# Altium schematic sheet Bank34-35.SchDoc: 02290_Sonoma_Controller
size B; ApprovedBy: J Johnson; CheckedBy: J Johnson; Author: sdfasdfdfAEFfasdFfaF; DrawnBy: J Johnson; Organization: Opsero Electronic Design; Address1: 21-915 Av. Marguerite-Bourgeoys; Address2: Québec (QC); Address3: G1S 3X4; DocumentNumber: OP009-001-SCH; Revision: B-1; SheetNumber: 08; SheetTotal: 16; Tel1: (581) 308-8830; Tel2: (581) 308-8830; Project: 02290_Sonoma_Controller; CheckedDate: yyyy-mm-dd; Sheet: Bank34 & Bank35; PageSetup: Record=PageOptions|CenterHorizontal=True|CenterVertical=True|PrintScale=1.08|XCorrection=1.00|YCorrection=1.00|PrintKind=0|BorderSize=5000000|LeftOffset=0|BottomOffset=0|Orientation=2|PaperLength=1000|PaperWidth=1000|Scale=100|PaperSource=7|PrintQuality=-4|MediaType=1|DitherType=10|PaperKind=Tabloid     [11 x 17 in]|PrintScaleMode=1; DrawDate: 2013-12-13; SchTitle: 02290_Sonoma_Controller; RevDescription: Removed QSPI, JP4/5, temp mon, JP6, U31; RevDate: 2019-05-24; RevBy: J Johnson; RevDescription2: Replaced D1 with RB521S30, J2 with L834-1G1T-S7; RevDescription3: Replaced FETs with TSM900N06CW RPG
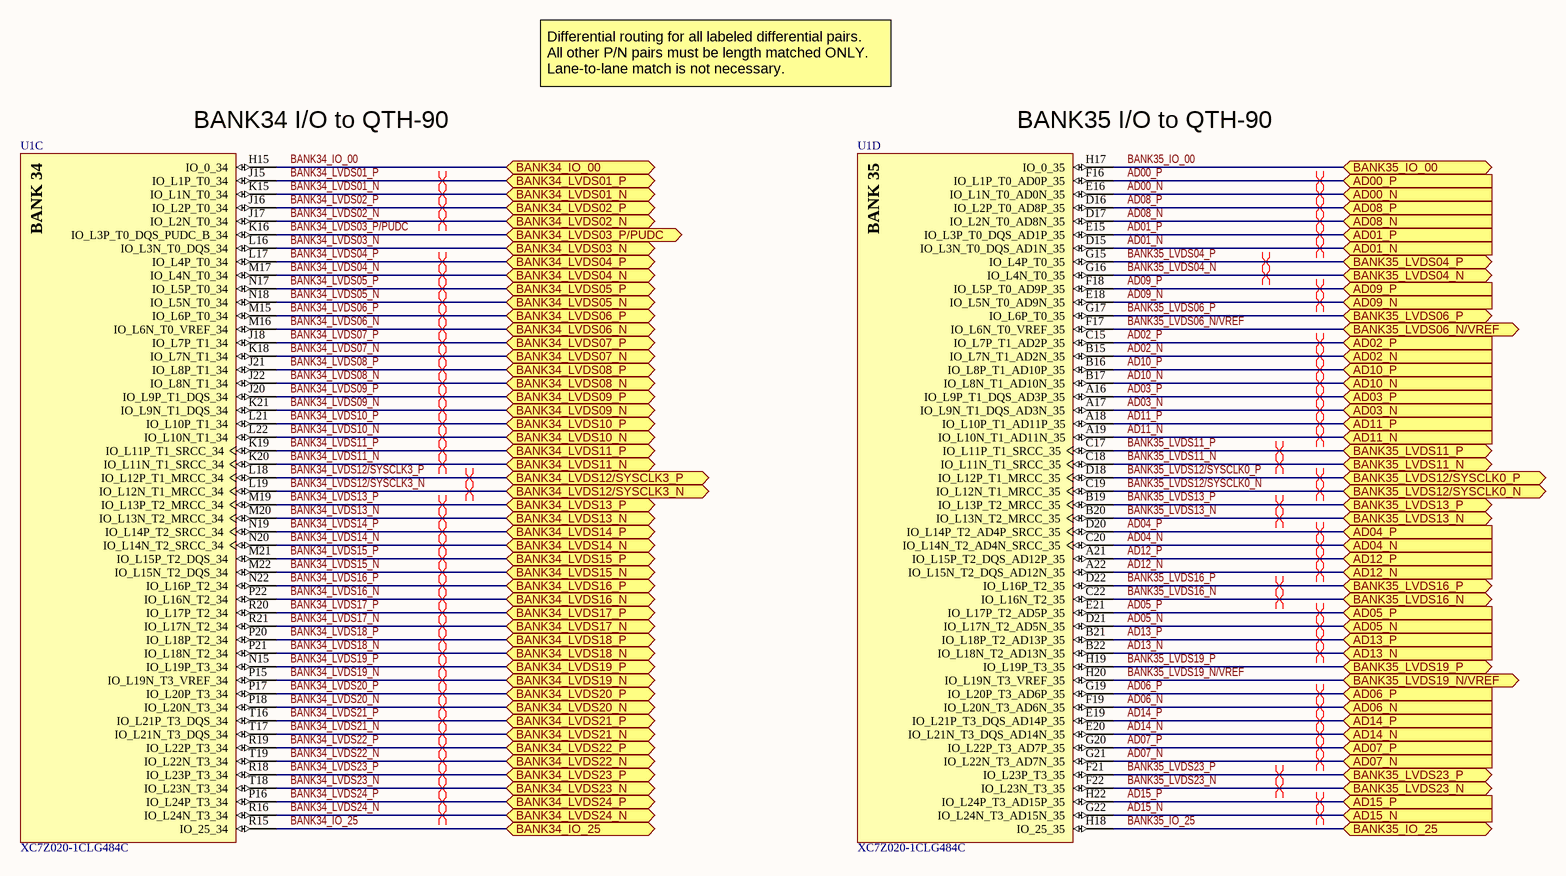
[diagram p0: Bank34-35.SchDoc]

## Parts
U1  XC7Z020-1CLG484C  [CLG484]  (parts C,D of 10)

## Ports
AD00_N (in), AD00_P (in), AD01_N (in), AD01_P (in), AD02_N (in), AD02_P (in), AD03_N (in), AD03_P (in), AD04_N (in), AD04_P (in), AD05_N (in), AD05_P (in), AD06_N (in), AD06_P (in), AD07_N (in), AD07_P (in), AD08_N (in), AD08_P (in), AD09_N (in), AD09_P (in), AD10_N (in), AD10_P (in), AD11_N (in), AD11_P (in), AD12_N (in), AD12_P (in), AD13_N (in), AD13_P (in), AD14_N (in), AD14_P (in), AD15_N (in), AD15_P (in), BANK34_IO_00 (bidir), BANK34_IO_25 (bidir), BANK34_LVDS01_N (bidir), BANK34_LVDS01_P (bidir), BANK34_LVDS02_N (bidir), BANK34_LVDS02_P (bidir), BANK34_LVDS03_N (bidir), BANK34_LVDS03_P/PUDC (bidir), BANK34_LVDS04_N (bidir), BANK34_LVDS04_P (bidir), BANK34_LVDS05_N (bidir), BANK34_LVDS05_P (bidir), BANK34_LVDS06_N (bidir), BANK34_LVDS06_P (bidir), BANK34_LVDS07_N (bidir), BANK34_LVDS07_P (bidir), BANK34_LVDS08_N (bidir), BANK34_LVDS08_P (bidir), BANK34_LVDS09_N (bidir), BANK34_LVDS09_P (bidir), BANK34_LVDS10_N (bidir), BANK34_LVDS10_P (bidir), BANK34_LVDS11_N (bidir), BANK34_LVDS11_P (bidir), BANK34_LVDS12/SYSCLK3_N (bidir), BANK34_LVDS12/SYSCLK3_P (bidir), BANK34_LVDS13_N (bidir), BANK34_LVDS13_P (bidir), BANK34_LVDS14_N (bidir), BANK34_LVDS14_P (bidir), BANK34_LVDS15_N (bidir), BANK34_LVDS15_P (bidir), BANK34_LVDS16_N (bidir), BANK34_LVDS16_P (bidir), BANK34_LVDS17_N (bidir), BANK34_LVDS17_P (bidir), BANK34_LVDS18_N (bidir), BANK34_LVDS18_P (bidir), BANK34_LVDS19_N (bidir), BANK34_LVDS19_P (bidir), BANK34_LVDS20_N (bidir), BANK34_LVDS20_P (bidir), BANK34_LVDS21_N (bidir), BANK34_LVDS21_P (bidir), BANK34_LVDS22_N (bidir), BANK34_LVDS22_P (bidir), BANK34_LVDS23_N (bidir), BANK34_LVDS23_P (bidir), BANK34_LVDS24_N (bidir), BANK34_LVDS24_P (bidir), BANK35_IO_00 (bidir), BANK35_IO_25 (bidir), BANK35_LVDS04_N (bidir), BANK35_LVDS04_P (bidir), BANK35_LVDS06_N/VREF (bidir), BANK35_LVDS06_P (bidir), BANK35_LVDS11_N (bidir), BANK35_LVDS11_P (bidir), BANK35_LVDS12/SYSCLK0_N (bidir), BANK35_LVDS12/SYSCLK0_P (bidir), BANK35_LVDS13_N (bidir), BANK35_LVDS13_P (bidir), BANK35_LVDS16_N (bidir), BANK35_LVDS16_P (bidir), BANK35_LVDS19_N/VREF (bidir), BANK35_LVDS19_P (bidir), BANK35_LVDS23_N (bidir), BANK35_LVDS23_P (bidir)

## Nets
AD00_N: U1.E16(IO_L1N_T0_AD0N_35) ; port AD00_N
AD00_P: U1.F16(IO_L1P_T0_AD0P_35) ; port AD00_P
AD01_N: U1.D15(IO_L3N_T0_DQS_AD1N_35) ; port AD01_N
AD01_P: U1.E15(IO_L3P_T0_DQS_AD1P_35) ; port AD01_P
AD02_N: U1.B15(IO_L7N_T1_AD2N_35) ; port AD02_N
AD02_P: U1.C15(IO_L7P_T1_AD2P_35) ; port AD02_P
AD03_N: U1.A17(IO_L9N_T1_DQS_AD3N_35) ; port AD03_N
AD03_P: U1.A16(IO_L9P_T1_DQS_AD3P_35) ; port AD03_P
AD04_N: U1.C20(IO_L14N_T2_AD4N_SRCC_35) ; port AD04_N
AD04_P: U1.D20(IO_L14P_T2_AD4P_SRCC_35) ; port AD04_P
AD05_N: U1.D21(IO_L17N_T2_AD5N_35) ; port AD05_N
AD05_P: U1.E21(IO_L17P_T2_AD5P_35) ; port AD05_P
AD06_N: U1.F19(IO_L20N_T3_AD6N_35) ; port AD06_N
AD06_P: U1.G19(IO_L20P_T3_AD6P_35) ; port AD06_P
AD07_N: U1.G21(IO_L22N_T3_AD7N_35) ; port AD07_N
AD07_P: U1.G20(IO_L22P_T3_AD7P_35) ; port AD07_P
AD08_N: U1.D17(IO_L2N_T0_AD8N_35) ; port AD08_N
AD08_P: U1.D16(IO_L2P_T0_AD8P_35) ; port AD08_P
AD09_N: U1.E18(IO_L5N_T0_AD9N_35) ; port AD09_N
AD09_P: U1.F18(IO_L5P_T0_AD9P_35) ; port AD09_P
AD10_N: U1.B17(IO_L8N_T1_AD10N_35) ; port AD10_N
AD10_P: U1.B16(IO_L8P_T1_AD10P_35) ; port AD10_P
AD11_N: U1.A19(IO_L10N_T1_AD11N_35) ; port AD11_N
AD11_P: U1.A18(IO_L10P_T1_AD11P_35) ; port AD11_P
AD12_N: U1.A22(IO_L15N_T2_DQS_AD12N_35) ; port AD12_N
AD12_P: U1.A21(IO_L15P_T2_DQS_AD12P_35) ; port AD12_P
AD13_N: U1.B22(IO_L18N_T2_AD13N_35) ; port AD13_N
AD13_P: U1.B21(IO_L18P_T2_AD13P_35) ; port AD13_P
AD14_N: U1.E20(IO_L21N_T3_DQS_AD14N_35) ; port AD14_N
AD14_P: U1.E19(IO_L21P_T3_DQS_AD14P_35) ; port AD14_P
AD15_N: U1.G22(IO_L24N_T3_AD15N_35) ; port AD15_N
AD15_P: U1.H22(IO_L24P_T3_AD15P_35) ; port AD15_P
BANK34_IO_00: U1.H15(IO_0_34) ; port BANK34_IO_00
BANK34_IO_25: U1.R15(IO_25_34) ; port BANK34_IO_25
BANK34_LVDS01_N: U1.K15(IO_L1N_T0_34) ; port BANK34_LVDS01_N
BANK34_LVDS01_P: U1.J15(IO_L1P_T0_34) ; port BANK34_LVDS01_P
BANK34_LVDS02_N: U1.J17(IO_L2N_T0_34) ; port BANK34_LVDS02_N
BANK34_LVDS02_P: U1.J16(IO_L2P_T0_34) ; port BANK34_LVDS02_P
BANK34_LVDS03_N: U1.L16(IO_L3N_T0_DQS_34) ; port BANK34_LVDS03_N
BANK34_LVDS03_P/PUDC: U1.K16(IO_L3P_T0_DQS_PUDC_B_34) ; port BANK34_LVDS03_P/PUDC
BANK34_LVDS04_N: U1.M17(IO_L4N_T0_34) ; port BANK34_LVDS04_N
BANK34_LVDS04_P: U1.L17(IO_L4P_T0_34) ; port BANK34_LVDS04_P
BANK34_LVDS05_N: U1.N18(IO_L5N_T0_34) ; port BANK34_LVDS05_N
BANK34_LVDS05_P: U1.N17(IO_L5P_T0_34) ; port BANK34_LVDS05_P
BANK34_LVDS06_N: U1.M16(IO_L6N_T0_VREF_34) ; port BANK34_LVDS06_N
BANK34_LVDS06_P: U1.M15(IO_L6P_T0_34) ; port BANK34_LVDS06_P
BANK34_LVDS07_N: U1.K18(IO_L7N_T1_34) ; port BANK34_LVDS07_N
BANK34_LVDS07_P: U1.J18(IO_L7P_T1_34) ; port BANK34_LVDS07_P
BANK34_LVDS08_N: U1.J22(IO_L8N_T1_34) ; port BANK34_LVDS08_N
BANK34_LVDS08_P: U1.J21(IO_L8P_T1_34) ; port BANK34_LVDS08_P
BANK34_LVDS09_N: U1.K21(IO_L9N_T1_DQS_34) ; port BANK34_LVDS09_N
BANK34_LVDS09_P: U1.J20(IO_L9P_T1_DQS_34) ; port BANK34_LVDS09_P
BANK34_LVDS10_N: U1.L22(IO_L10N_T1_34) ; port BANK34_LVDS10_N
BANK34_LVDS10_P: U1.L21(IO_L10P_T1_34) ; port BANK34_LVDS10_P
BANK34_LVDS11_N: U1.K20(IO_L11N_T1_SRCC_34) ; port BANK34_LVDS11_N
BANK34_LVDS11_P: U1.K19(IO_L11P_T1_SRCC_34) ; port BANK34_LVDS11_P
BANK34_LVDS12/SYSCLK3_N: U1.L19(IO_L12N_T1_MRCC_34) ; port BANK34_LVDS12/SYSCLK3_N
BANK34_LVDS12/SYSCLK3_P: U1.L18(IO_L12P_T1_MRCC_34) ; port BANK34_LVDS12/SYSCLK3_P
BANK34_LVDS13_N: U1.M20(IO_L13N_T2_MRCC_34) ; port BANK34_LVDS13_N
BANK34_LVDS13_P: U1.M19(IO_L13P_T2_MRCC_34) ; port BANK34_LVDS13_P
BANK34_LVDS14_N: U1.N20(IO_L14N_T2_SRCC_34) ; port BANK34_LVDS14_N
BANK34_LVDS14_P: U1.N19(IO_L14P_T2_SRCC_34) ; port BANK34_LVDS14_P
BANK34_LVDS15_N: U1.M22(IO_L15N_T2_DQS_34) ; port BANK34_LVDS15_N
BANK34_LVDS15_P: U1.M21(IO_L15P_T2_DQS_34) ; port BANK34_LVDS15_P
BANK34_LVDS16_N: U1.P22(IO_L16N_T2_34) ; port BANK34_LVDS16_N
BANK34_LVDS16_P: U1.N22(IO_L16P_T2_34) ; port BANK34_LVDS16_P
BANK34_LVDS17_N: U1.R21(IO_L17N_T2_34) ; port BANK34_LVDS17_N
BANK34_LVDS17_P: U1.R20(IO_L17P_T2_34) ; port BANK34_LVDS17_P
BANK34_LVDS18_N: U1.P21(IO_L18N_T2_34) ; port BANK34_LVDS18_N
BANK34_LVDS18_P: U1.P20(IO_L18P_T2_34) ; port BANK34_LVDS18_P
BANK34_LVDS19_N: U1.P15(IO_L19N_T3_VREF_34) ; port BANK34_LVDS19_N
BANK34_LVDS19_P: U1.N15(IO_L19P_T3_34) ; port BANK34_LVDS19_P
BANK34_LVDS20_N: U1.P18(IO_L20N_T3_34) ; port BANK34_LVDS20_N
BANK34_LVDS20_P: U1.P17(IO_L20P_T3_34) ; port BANK34_LVDS20_P
BANK34_LVDS21_N: U1.T17(IO_L21N_T3_DQS_34) ; port BANK34_LVDS21_N
BANK34_LVDS21_P: U1.T16(IO_L21P_T3_DQS_34) ; port BANK34_LVDS21_P
BANK34_LVDS22_N: U1.T19(IO_L22N_T3_34) ; port BANK34_LVDS22_N
BANK34_LVDS22_P: U1.R19(IO_L22P_T3_34) ; port BANK34_LVDS22_P
BANK34_LVDS23_N: U1.T18(IO_L23N_T3_34) ; port BANK34_LVDS23_N
BANK34_LVDS23_P: U1.R18(IO_L23P_T3_34) ; port BANK34_LVDS23_P
BANK34_LVDS24_N: U1.R16(IO_L24N_T3_34) ; port BANK34_LVDS24_N
BANK34_LVDS24_P: U1.P16(IO_L24P_T3_34) ; port BANK34_LVDS24_P
BANK35_IO_00: U1.H17(IO_0_35) ; port BANK35_IO_00
BANK35_IO_25: U1.H18(IO_25_35) ; port BANK35_IO_25
BANK35_LVDS04_N: U1.G16(IO_L4N_T0_35) ; port BANK35_LVDS04_N
BANK35_LVDS04_P: U1.G15(IO_L4P_T0_35) ; port BANK35_LVDS04_P
BANK35_LVDS06_N/VREF: U1.F17(IO_L6N_T0_VREF_35) ; port BANK35_LVDS06_N/VREF
BANK35_LVDS06_P: U1.G17(IO_L6P_T0_35) ; port BANK35_LVDS06_P
BANK35_LVDS11_N: U1.C18(IO_L11N_T1_SRCC_35) ; port BANK35_LVDS11_N
BANK35_LVDS11_P: U1.C17(IO_L11P_T1_SRCC_35) ; port BANK35_LVDS11_P
BANK35_LVDS12/SYSCLK0_N: U1.C19(IO_L12N_T1_MRCC_35) ; port BANK35_LVDS12/SYSCLK0_N
BANK35_LVDS12/SYSCLK0_P: U1.D18(IO_L12P_T1_MRCC_35) ; port BANK35_LVDS12/SYSCLK0_P
BANK35_LVDS13_N: U1.B20(IO_L13N_T2_MRCC_35) ; port BANK35_LVDS13_N
BANK35_LVDS13_P: U1.B19(IO_L13P_T2_MRCC_35) ; port BANK35_LVDS13_P
BANK35_LVDS16_N: U1.C22(IO_L16N_T2_35) ; port BANK35_LVDS16_N
BANK35_LVDS16_P: U1.D22(IO_L16P_T2_35) ; port BANK35_LVDS16_P
BANK35_LVDS19_N/VREF: U1.H20(IO_L19N_T3_VREF_35) ; port BANK35_LVDS19_N/VREF
BANK35_LVDS19_P: U1.H19(IO_L19P_T3_35) ; port BANK35_LVDS19_P
BANK35_LVDS23_N: U1.F22(IO_L23N_T3_35) ; port BANK35_LVDS23_N
BANK35_LVDS23_P: U1.F21(IO_L23P_T3_35) ; port BANK35_LVDS23_P

## Layout directives
differential pair: AD00_N, AD00_P, AD01_N, AD01_P, AD02_N, AD02_P, AD03_N, AD03_P, AD04_N, AD04_P, AD05_N, AD05_P, AD06_N, AD06_P, AD07_N, AD07_P, AD08_N, AD08_P, AD09_N, AD09_P, AD10_N, AD10_P, AD11_N, AD11_P, AD12_N, AD12_P, AD13_N, AD13_P, AD14_N, AD14_P, AD15_N, AD15_P, BANK34_LVDS01_N, BANK34_LVDS01_P, BANK34_LVDS02_N, BANK34_LVDS02_P, BANK34_LVDS04_N, BANK34_LVDS04_P, BANK34_LVDS05_N, BANK34_LVDS05_P, BANK34_LVDS06_N, BANK34_LVDS06_P, BANK34_LVDS07_N, BANK34_LVDS07_P, BANK34_LVDS08_N, BANK34_LVDS08_P, BANK34_LVDS09_N, BANK34_LVDS09_P, BANK34_LVDS10_N, BANK34_LVDS10_P, BANK34_LVDS11_N, BANK34_LVDS11_P, BANK34_LVDS12/SYSCLK3_N, BANK34_LVDS12/SYSCLK3_P, BANK34_LVDS13_N, BANK34_LVDS13_P, BANK34_LVDS14_N, BANK34_LVDS14_P, BANK34_LVDS15_N, BANK34_LVDS15_P, BANK34_LVDS16_N, BANK34_LVDS16_P, BANK34_LVDS17_N, BANK34_LVDS17_P, BANK34_LVDS18_N, BANK34_LVDS18_P, BANK34_LVDS19_N, BANK34_LVDS19_P, BANK34_LVDS20_N, BANK34_LVDS20_P, BANK34_LVDS21_N, BANK34_LVDS21_P, BANK34_LVDS22_N, BANK34_LVDS22_P, BANK34_LVDS23_N, BANK34_LVDS23_P, BANK34_LVDS24_N, BANK34_LVDS24_P, BANK35_LVDS04_N, BANK35_LVDS04_P, BANK35_LVDS11_N, BANK35_LVDS11_P, BANK35_LVDS12/SYSCLK0_N, BANK35_LVDS12/SYSCLK0_P, BANK35_LVDS13_N, BANK35_LVDS13_P, BANK35_LVDS16_N, BANK35_LVDS16_P, BANK35_LVDS23_N, BANK35_LVDS23_P

## Notes on the sheet
- Differential routing for all labeled differential pairs.
  All other P/N pairs must be length matched ONLY.
  Lane-to-lane match is not necessary.
- (near U1) BANK34 I/O to QTH-90
- (near U1) BANK35 I/O to QTH-90
- REV.
- DESCRIPTION
- DATE
- APPROVED
- Incal Inc.
- SHEET
- TITLE
- CONFIG.
- PROJECT
- SIZE
- SCH P/N.
- DRAWN
- B
- OF
- (in symbol XC7Z020-1CLG484C, part C) BANK 34
- (in symbol XC7Z020-1CLG484C, part D) BANK 35

## Library data of the parts
U1 = XC7Z020-1CLG484C: 667 MHz Zynq™-7000 AP SoC, 130 PS I/O, 200 FPGA I/O, 484-Ball BGA, Speed Grade 1, Commercial Grade; Manufacturer: Xilinx; Extensible Block RAM (# 36Kb Blocks): 560 KB (140); Flip Flops: 106400; LUTs: 53200; Speed Grade: -1; DatasheetVersion: v1.2; PackageVersion: Rev 1.1; PackageReference: CLG484; PackageDescription: Wire-Bond Chip-Scale BGA, Body 19 x 19 mm, 0.8 mm Pitch; Generic Part Number: XC7Z020; RoHS: True; Mounting Technology: Surface Mount; Code_JEDEC: MO-275-PPAA-2; PartNumber: XC7Z020-1CLG484C; ComponentLink1Description: Datasheet; ComponentLink1URL: http://www.xilinx.com/support/documentation/data_sheets/ds190-Zynq-7000-Overview.pdf; ComponentLink2Description: Package Specification; ComponentLink2URL: http://www.xilinx.com/support/documentation/user_guides/ug865-Zynq-7000-Pkg-Pinout.pdf; ComponentLink3Description: DC and AC Switching Characteristics; ComponentLink3URL: http://www.xilinx.com/support/documentation/data_sheets/ds187-XC7Z010-XC7Z020-Data-Sheet.pdf; ComponentLink4Description: Package File; ComponentLink4URL: http://www.xilinx.com/support/packagefiles/z7packages/xc7z020clg484pkg.txt; ComponentLink5Description: Packaging and Pinout; ComponentLink5URL: http://www.xilinx.com/support/documentation/user_guides/ug865-Zynq-7000-Pkg-Pinout.pdf; ComponentLink6Description: PCB and Layout Guide; ComponentLink6URL: http://www.xilinx.com/support/documentation/user_guides/ug483_7Series_PCB.pdf; Part Ref: XC7Z020-1CLG484C; Status: Active; Value: XC7Z020-1CLG484C; Manufacturer 1: Xilinx; Mfg Part Number 1: XC7Z020-1CLG484C; Package: CLG484